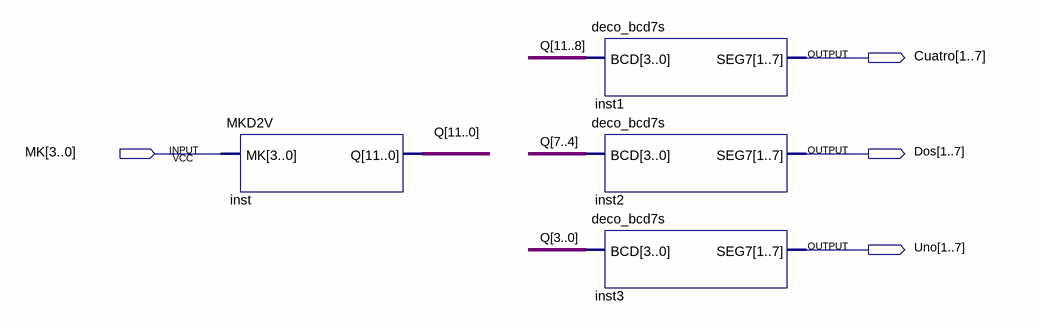
[diagram p0: schematic sheet]
// Quartus schematic 2021_PAE_C4_Leccion.bdf as structural Verilog: 4 symbols, 4 pins
module \2021_PAE_C4_Leccion  (
  input  [3:0] MK,
  output [1:7] Cuatro,
  output [1:7] Dos,
  output [1:7] Uno
);

  wire [11:0] Q;

  MKD2V inst (.MK(MK), .Q(Q));
  deco_bcd7s inst1 (.BCD(Q[11:8]), .SEG7(Cuatro));
  deco_bcd7s inst2 (.BCD(Q[7:4]), .SEG7(Dos));
  deco_bcd7s inst3 (.BCD(Q[3:0]), .SEG7(Uno));
endmodule
